# Altium schematic sheet 128x16bit_SPI_EEPROM.SchDoc: 128x16bit SPI EEPROM
size A4; CircuitClass: Storage; CircuitSubClass: EPROM; MemorySize: 2K BIT; MemoryLayout: 128 x 16 BIT; PageSetup: Record=PageOptions|CenterHorizontal=True|CenterVertical=True|PrintScale=1.00|XCorrection=1.00|YCorrection=1.00|PrintKind=0|BorderSize=5000000|LeftOffset=0|BottomOffset=0|Orientation=2|PaperLength=1000|PaperWidth=1000|Scale=100|PaperSource=7|PrintQuality=-4|MediaType=1|DitherType=10|PaperKind=Letter|PrintScaleMode=1; Maxsupply: 5V5; Minsupply: 2V5
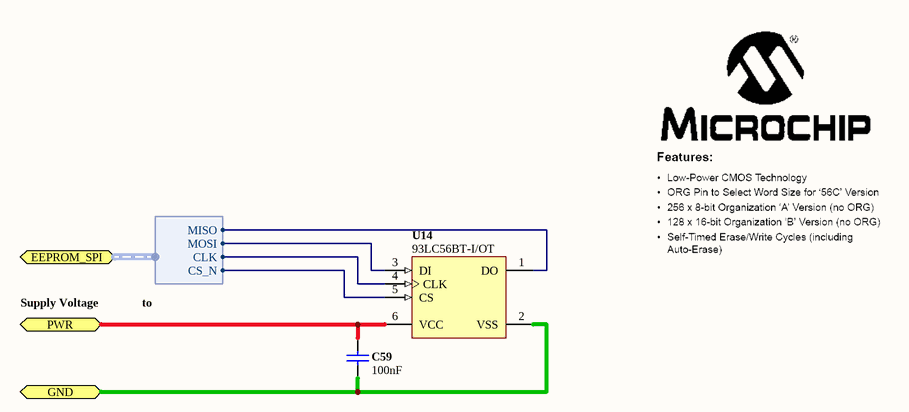
[diagram p0: 128x16bit_SPI_EEPROM.SchDoc]

## Parts
C59  value 100nF  [CAPC0402(1005)60_N]  (hidden comment: CAP 100nF 10V 0402(1005))
U14  93LC56BT-I/OT  [SOT-23-OT6_N]

## Ports
EEPROM_SPI (harness FTDI_SPI), GND, PWR

## Harnesses
FTDI_SPI: CLK, CS_N, MOSI, MISO

## Nets
GND: C59.2 U14.2(VSS) ; port GND
PWR: C59.1 U14.6(VCC) ; port PWR
NetU14_1: U14.1(DO) ; port EEPROM_SPI.MISO
NetU14_3: U14.3(DI) ; port EEPROM_SPI.MOSI
NetU14_4: U14.4(CLK) ; port EEPROM_SPI.CLK
NetU14_5: U14.5(CS) ; port EEPROM_SPI.CS_N

## Notes on the sheet
- Supply Voltage
- to
- Sheet Title
- Project Title
- Size:
- Date:
- A4
- Item:
- Time:
- Revision:
- Sheet
- of
- File:

## Library data of the parts
C59 = CMP-1034-02065-1: CAP 100nF 10V ±10% 0402 (1005 Metric) Thickness 0.6mm SMD; Case-EIA: 0402; Case-Metric: 1005; Rated Voltage: 10 V; Max Thickness: 0.6 mm; Tolerance: ±10%; Technology: SMT
U14 = CMP-0162-00356-1: 2K, 128x16-bit, 2.5V Microwire Serial EEPROM, 6-Pin SOT-23, Industrial Temperature, Tape and Reel; DatasheetVersion: revF, May-2008; Code_IPC: SOT26A-6; PackageReference: SOT-23-OT6; PackageVersion: revBB, Aug-2009; PackageDescription: 6-Lead Plastic Small Outline Transistor (OT) [SOT-23]